# Altium schematic sheet AIRControl.SchDoc: AIR Control
size A4; DrawnBy: Jarod Krane; Organization: Altium Limited; Address1: L3, 12a Rodborough Rd; Address2: Frenchs Forest; Address3: NSW; Address4: Australia 2086; Revision: 0; SheetNumber: 11; SheetTotal: 11
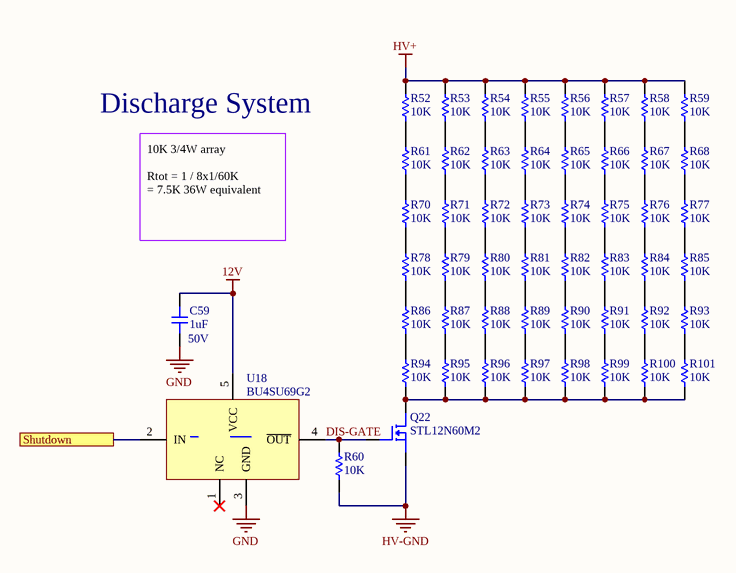
[diagram p0: AIRControl.SchDoc]

## Parts
C59  1uF  Voltage Rating: 50V  [CAP-0805]
Q22  STL12N60M2  [POWERFLAT-FET]
R52  10K  [RES-1206]
R53  10K  [RES-1206]
R54  10K  [RES-1206]
R55  10K  [RES-1206]
R56  10K  [RES-1206]
R57  10K  [RES-1206]
R58  10K  [RES-1206]
R59  10K  [RES-1206]
R60  10K  [RES-0603]
R61  10K  [RES-1206]
R62  10K  [RES-1206]
R63  10K  [RES-1206]
R64  10K  [RES-1206]
R65  10K  [RES-1206]
R66  10K  [RES-1206]
R67  10K  [RES-1206]
R68  10K  [RES-1206]
R70  10K  [RES-1206]
R71  10K  [RES-1206]
R72  10K  [RES-1206]
R73  10K  [RES-1206]
R74  10K  [RES-1206]
R75  10K  [RES-1206]
R76  10K  [RES-1206]
R77  10K  [RES-1206]
R78  10K  [RES-1206]
R79  10K  [RES-1206]
R80  10K  [RES-1206]
R81  10K  [RES-1206]
R82  10K  [RES-1206]
R83  10K  [RES-1206]
R84  10K  [RES-1206]
R85  10K  [RES-1206]
R86  10K  [RES-1206]
R87  10K  [RES-1206]
R88  10K  [RES-1206]
R89  10K  [RES-1206]
R90  10K  [RES-1206]
R91  10K  [RES-1206]
R92  10K  [RES-1206]
R93  10K  [RES-1206]
R94  10K  [RES-1206]
R95  10K  [RES-1206]
R96  10K  [RES-1206]
R97  10K  [RES-1206]
R98  10K  [RES-1206]
R99  10K  [RES-1206]
R100  10K  [RES-1206]
R101  10K  [RES-1206]
U18  BU4SU69G2  [SSOP5]

## Ports
Shutdown

## Nets
12V: C59.2 U18.5(VCC)
GND: C59.1 U18.3(GND)
HV+: R52.2 R53.2 R54.2 R55.2 R56.2 R57.2 R58.2 R59.2
HV-GND: Q22.3 R60.1
DIS-GATE: Q22.1 R60.2 U18.4(~{OUT})
Shutdown: U18.2(IN) ; port Shutdown
NetQ22_2: Q22.2 R94.1 R95.1 R96.1 R97.1 R98.1 R99.1 R100.1 R101.1
NetR52_1: R52.1 R61.2
NetR53_1: R53.1 R62.2
NetR54_1: R54.1 R63.2
NetR55_1: R55.1 R64.2
NetR56_1: R56.1 R65.2
NetR57_1: R57.1 R66.2
NetR58_1: R58.1 R67.2
NetR59_1: R59.1 R68.2
NetR61_1: R61.1 R70.2
NetR62_1: R62.1 R71.2
NetR63_1: R63.1 R72.2
NetR64_1: R64.1 R73.2
NetR65_1: R65.1 R74.2
NetR66_1: R66.1 R75.2
NetR67_1: R67.1 R76.2
NetR68_1: R68.1 R77.2
NetR70_1: R70.1 R78.2
NetR71_1: R71.1 R79.2
NetR72_1: R72.1 R80.2
NetR73_1: R73.1 R81.2
NetR74_1: R74.1 R82.2
NetR75_1: R75.1 R83.2
NetR76_1: R76.1 R84.2
NetR77_1: R77.1 R85.2
NetR78_1: R78.1 R86.2
NetR79_1: R79.1 R87.2
NetR80_1: R80.1 R88.2
NetR81_1: R81.1 R89.2
NetR82_1: R82.1 R90.2
NetR83_1: R83.1 R91.2
NetR84_1: R84.1 R92.2
NetR85_1: R85.1 R93.2
NetR86_1: R86.1 R94.2
NetR87_1: R87.1 R95.2
NetR88_1: R88.1 R96.2
NetR89_1: R89.1 R97.2
NetR90_1: R90.1 R98.2
NetR91_1: R91.1 R99.2
NetR92_1: R92.1 R100.2
NetR93_1: R93.1 R101.2

Not connected (* = marked no-connect by the designer): U18 1(NC)*

## Notes on the sheet
- Discharge System
- 10K 3/4W array
  Rtot = 1 / 8x1/60K
  = 7.5K 36W equivalent
- Title
- Size:
- Date:
- A4
- Number:
- Time:
- Revision:
- Sheet
- of
- File:

## Library data of the parts
C59 = 0805-1uF-50V: CAP CER 1UF 50V X5R 0805; Manufacturer: KEMET; Manufacturer Part Number: C0805C105K5PACTU; Dielectric Material: Ceramic; Tolerance: 10%; Supplier 1: Digi-Key; Stock 1: 7193; Pricing 1: 1=0.33, 10=0.23, 100=0.1378, 500=0.10334, 1000=0.08726 (USD); Mount: Surface Mount; Case/Package: 0805; Weight: 0.000194oz; Case Code (Metric): 2012; Case Code (Imperial): 0805; Min Operating Temperature: -55°C; Max Operating Temperature: 85°C; Dielectric: X5R; Packaging: Tape and Reel; Termination: SMD/SMT; Voltage Rating (DC): 50V; Package Quantity: 2500; Length: 0.079inch; Width: 0.049inch; Thickness: 0.055inch; REACH SVHC: No SVHC; Lead Free: Lead Free; ComponentLink1URL: https://api.kemet.com/component-edge/download/datasheet/C0805C105K5PAC7800.pdf?src-supplier=Digi-Key; ComponentLink1Description: https://api.kemet.com/component-edge/download/datasheet/C0805C105K5PAC7800.pdf?src-supplier=Digi-Key; ComponentLink2URL: http://www.farnell.com/datasheets/2746140.pdf?src-supplier=Farnell; ComponentLink2Description: http://www.farnell.com/datasheets/2746140.pdf?src-supplier=Farnell; ComponentLink3URL: http://www.mouser.com/ds/2/212/KEM_C1006_X5R_SMD-1103249.pdf?src-supplier=Mouser; ComponentLink3Description: http://www.mouser.com/ds/2/212/KEM_C1006_X5R_SMD-1103249.pdf?src-supplier=Mouser; ComponentLink4URL: http://www.farnell.com/datasheets/2746140.pdf?src-supplier=Newark; ComponentLink4Description: http://www.farnell.com/datasheets/2746140.pdf?src-supplier=Newark; ComponentLink5URL: http://www.farnell.com/datasheets/2032728.pdf?src-supplier=Element14; ComponentLink5Description: http://www.farnell.com/datasheets/2032728.pdf?src-supplier=Element14; Supplier Part Number 1: 399-15436-6-ND; Capacitance: 1uF
Q22 = STL12N60M2: MOSFET N-CH 600V 6.5A POWERFLAT; Manufacturer: STMicroelectronics; Rds On Max: 495mR; Input Capacitance: 538pF; Max Power Dissipation: 52W; Supplier 1: Digi-Key; Manufacturer Part Number: STL12N60M2; Stock 1: 2323; Pricing 1: 1=1.67, 10=1.491, 25=1.4156, 100=1.1628, 500=0.96056, 1000=0.8043 (USD); Mount: Surface Mount; Number of Pins: 8; Min Operating Temperature: -55°C; Max Operating Temperature: 150°C; Packaging: Tape and Reel; Drain to Source Voltage (Vdss): 600V; Continuous Drain Current (ID): 6.5A; ComponentLink1URL: http://www.st.com/content/ccc/resource/technical/document/datasheet/65/14/17/85/17/67/44/ac/DM00187264.pdf/files/DM00187264.pdf/jcr:content/translations/en.DM00187264.pdf?src-supplier=Digi-Key; ComponentLink1Description: http://www.st.com/content/ccc/resource/technical/document/datasheet/65/14/17/85/17/67/44/ac/DM00187264.pdf/files/DM00187264.pdf/jcr:content/translations/en.DM00187264.pdf?src-supplier=Digi-Key; ComponentLink2URL: http://www.mouser.com/ds/2/389/stl12n60m2-956130.pdf?src-supplier=Mouser; ComponentLink2Description: http://www.mouser.com/ds/2/389/stl12n60m2-956130.pdf?src-supplier=Mouser; Supplier Part Number 1: 497-16039-6-ND
R52-R59 R61-R68 R70-R101 = 1206-10KR: RES SMD 10K OHM 1% 3/4W 1206; Manufacturer: Vishay Dale; Manufacturer Part Number: RCA120610K0FKEAHP; Resistance: 10kR; Max Power Dissipation: 750mW; Temperature Coefficient: 100ppm/°C; Supplier 1: Digi-Key; Stock 1: 6454; Pricing 1: 1=0.52, 10=0.369, 100=0.1919, 1000=0.10332, 2500=0.09963 (USD); Case/Package: 1206; Case Code (Imperial): 1206; Case Code (Metric): 3216; Min Operating Temperature: -55°C; Max Operating Temperature: 155°C; Resistor Type: Thick Film; Features: Automotive AEC-Q200,Anti-Sulfur; Packaging: Tape and Reel; Tolerance: 1%; Number of Terminations: 2; RoHS Compliant: Yes; ComponentLink1URL: http://www.vishay.com/docs/20067/rcahp.pdf?src-supplier=Digi-Key; ComponentLink1Description: http://www.vishay.com/docs/20067/rcahp.pdf?src-supplier=Digi-Key; Supplier Part Number 1: 541-3251-6-ND
R60 = 0603-10KR: RES SMD 10K OHM 5% 1/10W 0603; Manufacturer: Yageo; Manufacturer Part Number: RC0603JR-0710KL; Resistance: 10kR; Voltage Rating (DC): 50V; Temperature Coefficient: 100ppm/°C; Power Rating: 100mW; Supplier 1: Digi-Key; Stock 1: 3006558; Pricing 1: 1=0.1, 10=0.019, 100=0.0077, 1000=0.00347, 2500=0.00301 (USD); Case/Package: 0603; Number of Pins: 2; Contact Plating: Tin,Matte; Case Code (Imperial): 0603; Case Code (Metric): 1608; Min Operating Temperature: -55°C; Max Operating Temperature: 155°C; Packaging: Tape and Reel; Tolerance: 5%; Composition: Thick Film; Voltage Rating: 50V; Termination: SMD/SMT; Military Standard: Not; Features: Moisture Resistant; Max Power Dissipation: 100mW; Number of Terminations: 2; Length: 0.063inch; Width: 0.031inch; Depth: 0.8mm; Height - Seated (Max): 0.022inch; Radiation Hardening: No; REACH SVHC: Unknown; Lead Free: Lead Free; ComponentLink1URL: http://www.yageo.com/documents/recent/PYu-RC_Group_51_RoHS_L_10.pdf?src-supplier=Digi-Key; ComponentLink1Description: http://www.yageo.com/documents/recent/PYu-RC_Group_51_RoHS_L_10.pdf?src-supplier=Digi-Key; Supplier Part Number 1: 311-10KGRDKR-ND
U18 = BU4SU69G2: IC INVERTER 1CH 1-INP 5SSOP; Manufacturer: Rohm; Manufacturer Part Number: BU4SU69G2-TR; Number of Inputs: 1; Propagation Delay: 25ns; Max Supply Voltage: 16V; Min Supply Voltage: 3V; Quiescent Current: 1uA; High Level Output Current: 3.4mA; Supplier 1: Digi-Key; Stock 1: 2901; Pricing 1: 1=0.89, 10=0.781, 25=0.7336, 100=0.5986, 250=0.556, 500=0.47318, 1000=0.37855 (USD); Mount: Surface Mount; Case/Package: SSOP; Number of Pins: 5; Contact Plating: Copper,Tin; Min Operating Temperature: -40°C; Max Operating Temperature: 85°C; Logic Function: Inverter; Number of Elements: 1; Package Quantity: 1; Packaging: Tape and Reel; Number of Circuits: 1; Low Level Output Current: 3.4mA; Turn-On Delay Time: 25ns; Number of Gates: 1; Series: 4S; Number of Functions: 1; Supply Voltage-Nom: 16V; Technology: CMOS; Radiation Hardening: No; Lead Free: Lead Free; RoHS Compliant: Yes; ComponentLink1URL: http://www.mouser.com/ds/2/348/bu4su69g2-e-962457.pdf?src-supplier=Mouser; ComponentLink1Description: http://www.mouser.com/ds/2/348/bu4su69g2-e-962457.pdf?src-supplier=Mouser; ComponentLink2URL: http://rohmfs.rohm.com/en/products/databook/datasheet/ic/logic_switch/standard_logic/bu4s01g2-e.pdf?src-supplier=Avnet; ComponentLink2Description: http://rohmfs.rohm.com/en/products/databook/datasheet/ic/logic_switch/standard_logic/bu4s01g2-e.pdf?src-supplier=Avnet; ComponentLink3URL: https://www.verical.com/server-webapp/html/getDatasheet?partID=458866&src-supplier=Verical; ComponentLink3Description: https://www.verical.com/server-webapp/html/getDatasheet?partID=458866&src-supplier=Verical; ComponentLink4URL: http://rohmfs.rohm.com/en/techdata_basic/ic/package/ssop5_1-e.pdf?src-supplier=Digi-Key; ComponentLink4Description: http://rohmfs.rohm.com/en/techdata_basic/ic/package/ssop5_1-e.pdf?src-supplier=Digi-Key; ComponentLink5URL: http://rohmfs.rohm.com/en/products/databook/datasheet/ic/logic_switch/standard_logic/bu4su69g2-e.pdf?src-supplier=Digi-Key; ComponentLink5Description: http://rohmfs.rohm.com/en/products/databook/datasheet/ic/logic_switch/standard_logic/bu4su69g2-e.pdf?src-supplier=Digi-Key; ComponentLink6URL: https://produktinfo.conrad.com/datenblaetter/125000-149999/140507-da-01-en-IC_BU4SU69G2_TR_SSOP5.pdf?src-supplier=Conrad; ComponentLink6Description: https://produktinfo.conrad.com/datenblaetter/125000-149999/140507-da-01-en-IC_BU4SU69G2_TR_SSOP5.pdf?src-supplier=Conrad; Supplier Part Number 1: BU4SU69G2DKR-ND